# Altium project PCB_Project.PrjPcb
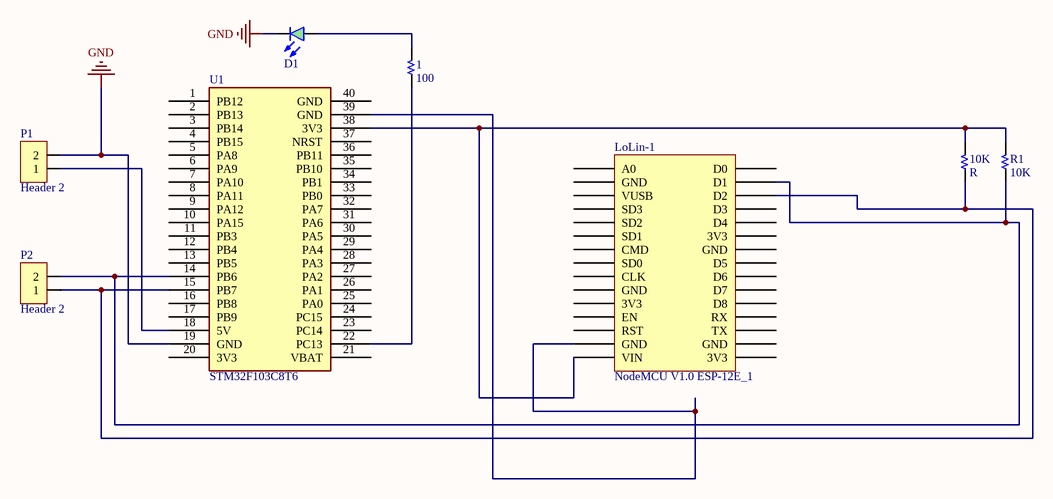
[diagram p0: Sheet2.SchDoc]
1 sheet, 8 parts. Net scope: global (net labels, ports and power ports of the same name join across sheets).
Board file: PCB3.PcbDoc

## Sheet Sheet2.SchDoc
size B; SheetNumber: 1; SheetTotal: 1

### Parts
1  100  [R 1/4W/300]
10K  R  [R 1/4W/300]
D1  LED GREEN  [LED 10MM - GREEN]  (value not drawn)
LoLin-1  NodeMCU V1.0 ESP-12E_1  [LoLin NodeMcu V3]
P1  Header 2  [HDR/Terminal/2]
P2  Header 2  [HDR/Header/2]
R1  10K  [R 1/4W/300]
U1  STM32F103C8T6  [Stm32 BluePill]

### Nets
GND: D1.2(K) P1.2 U1.19(GND)
Net1_1: 1.1 U1.22(PC13)
Net1_2: 1.2 D1.1(A)
Net10K_1: 10K.1 LoLin-1.D2 P2.1 U1.15(PB7)
Net10K_2: 10K.2 LoLin-1.VIN R1.2 U1.38(3V3)
NetLoLin-1_D1: LoLin-1.D1 P2.2 R1.1 U1.14(PB6)
NetLoLin-1_GND: LoLin-1.GND U1.39(GND)
NetP1_1: P1.1 U1.18(5V)

Not connected (* = marked no-connect by the designer): LoLin-1 3V3 A0 CLK CMD D0 D3 D4 D5 D6 D7 D8 EN RST RX SD0 SD1 SD2 SD3 TX VUSB; U1 1(PB12) 2(PB13) 3(PB14) 4(PB15) 5(PA8) 6(PA9) 7(PA10) 8(PA11) 9(PA12) 10(PA15) 11(PB3) 12(PB4) 13(PB5) 16(PB8) 17(PB9) 20(3V3) 21(VBAT) 23(PC14) 24(PC15) 25(PA0) 26(PA1) 27(PA2) 28(PA3) 29(PA4) 30(PA5) 31(PA6) 32(PA7) 33(PB0) 34(PB1) 35(PB10) 36(PB11) 37(NRST) 40(GND)

### Library data of the parts
1 10K R1 = Resistor
D1 = LED GREEN: Typical LED 3-pin 2-color
LoLin-1 = NodeMCU V1.0 ESP-12E_1: LoLin NodeMCU V3
P1 P2 = Header 2: Header, 2-Pin
U1 = BluePill: Designed By @Alixahedi